# EAGLE schematic VCAMatrixBottom (EAGLE 8.0.2)
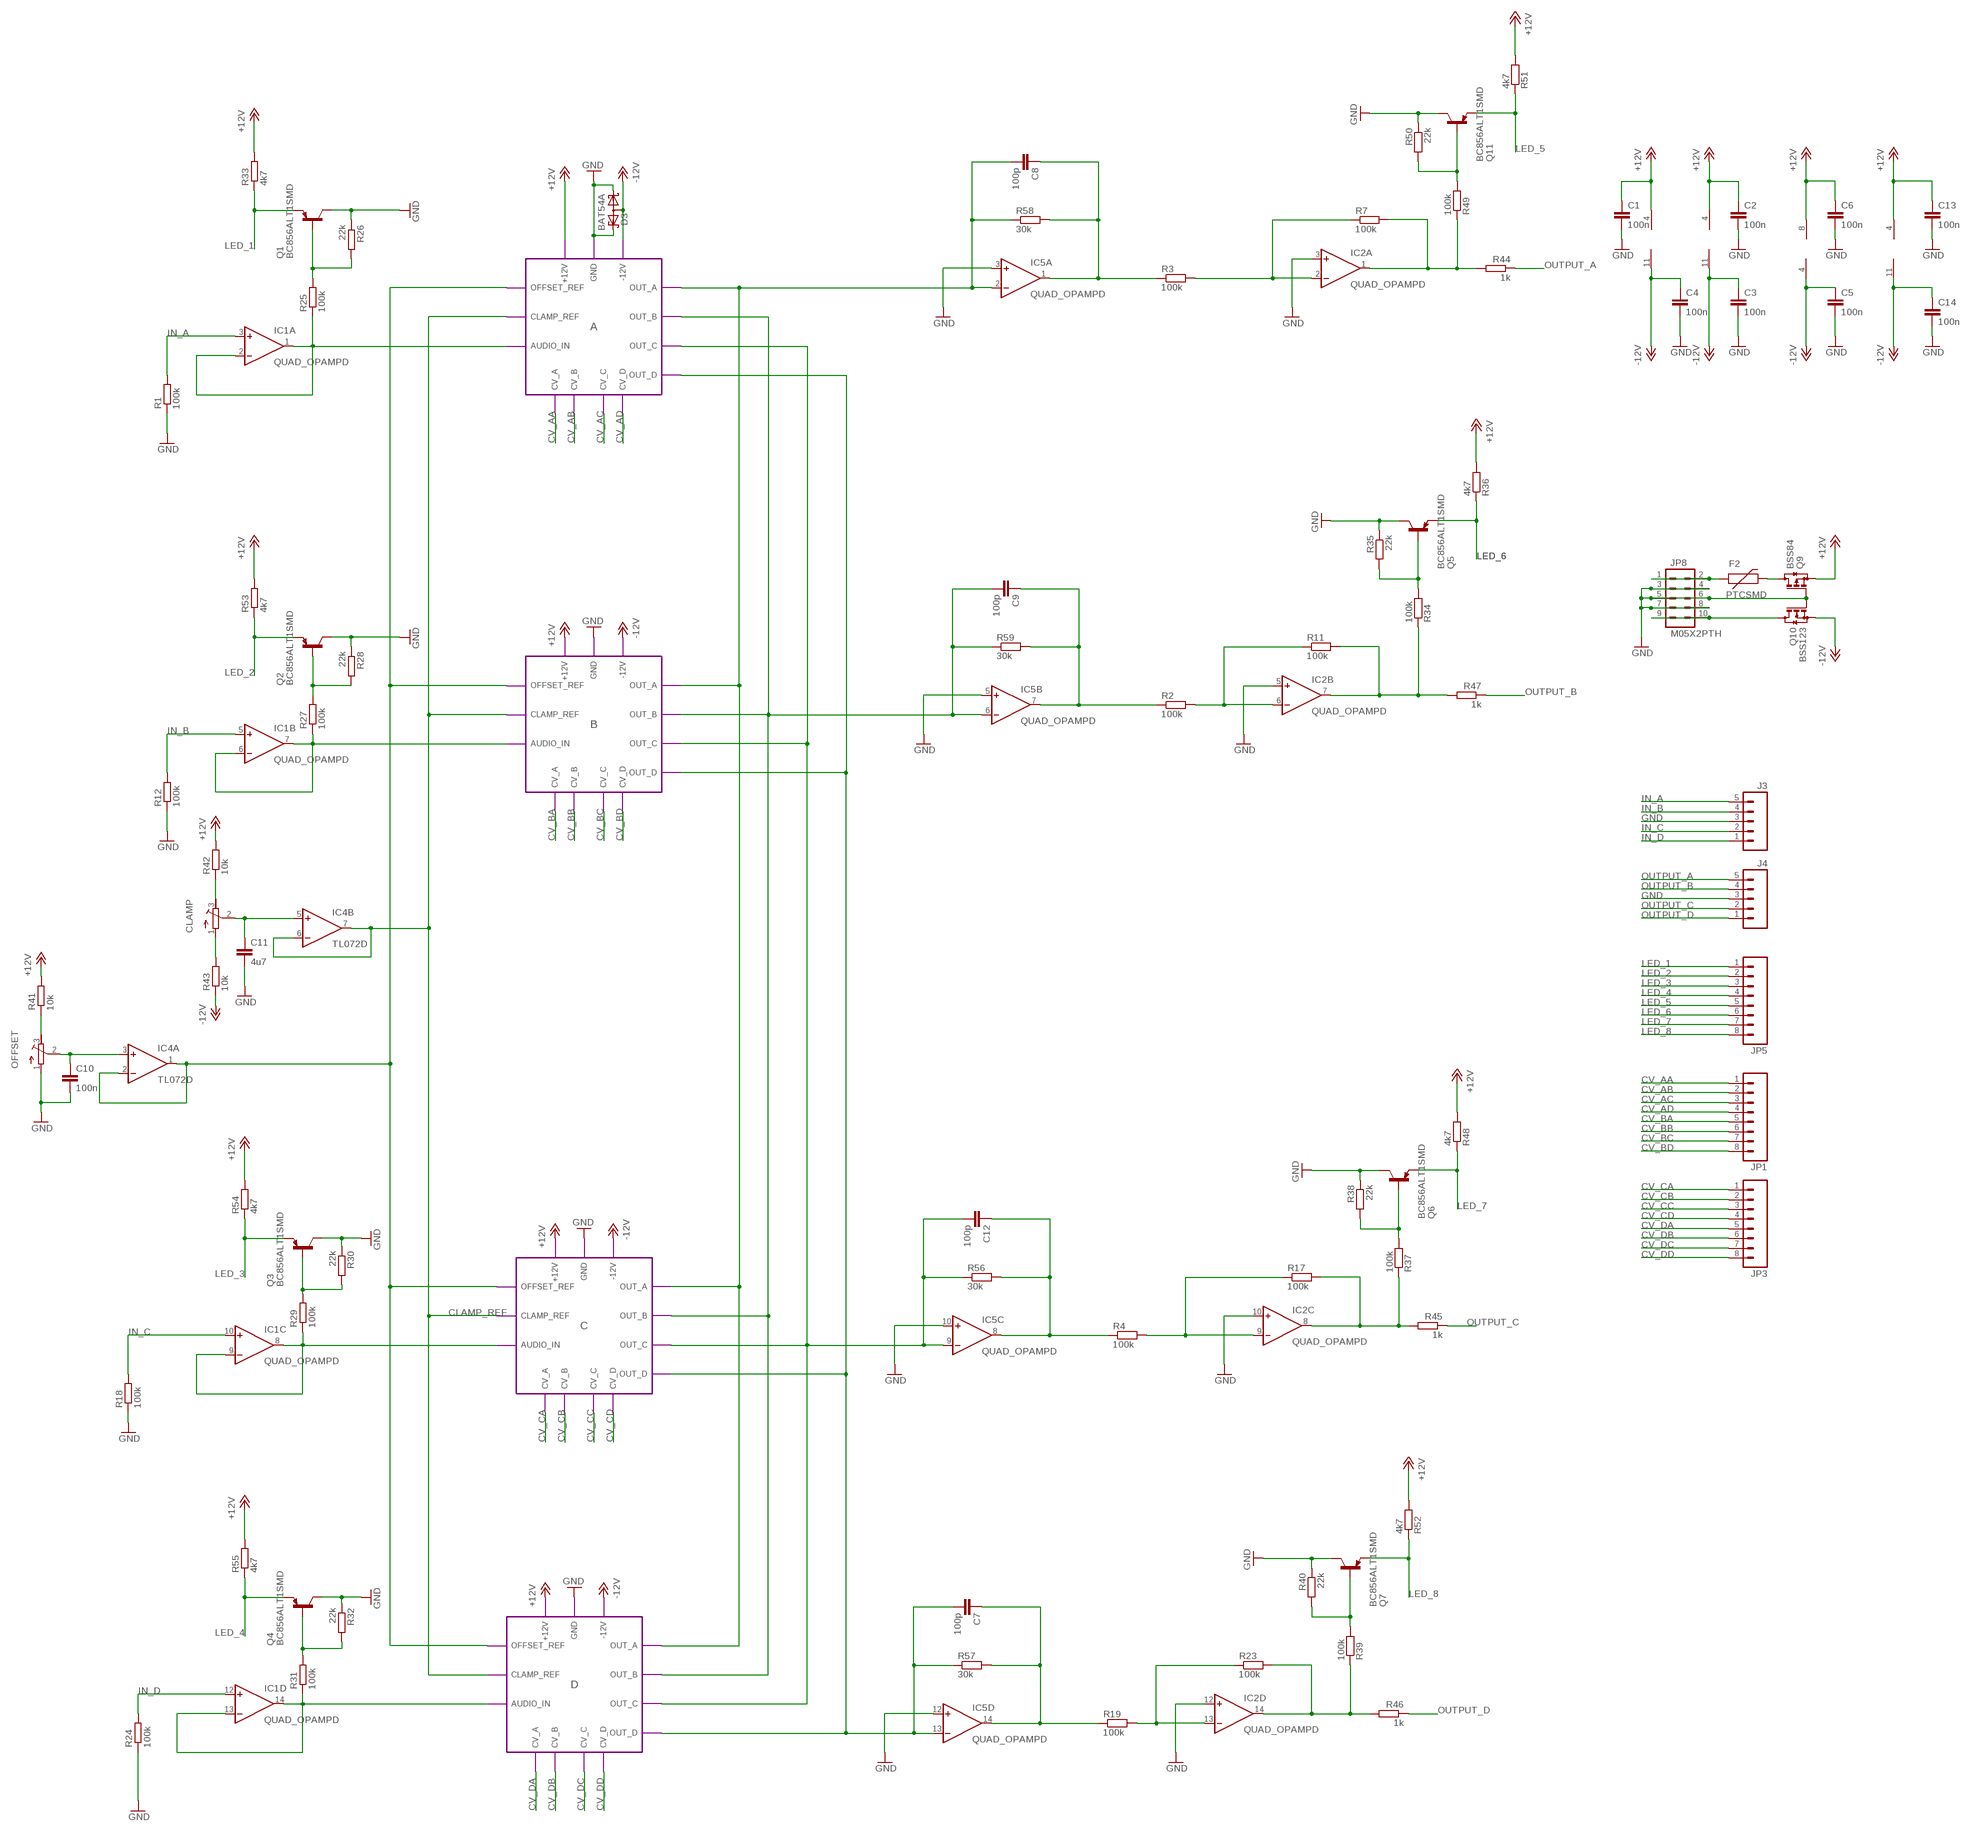
[diagram p0: schematic, sheet 1]

## Parts
C1  100n  C-EUC0603K  [C0603K]
C2  100n  C-EUC0603K  [C0603K]
C3  100n  C-EUC0603K  [C0603K]
C4  100n  C-EUC0603K  [C0603K]
C5  100n  C-EUC0603K  [C0603K]
C6  100n  C-EUC0603K  [C0603K]
C7  100p  C-EUC0603K  [C0603K]
C8  100p  C-EUC0603K  [C0603K]
C9  100p  C-EUC0603K  [C0603K]
C10  100n  C-EUC0603K  [C0603K]
C11  4u7  C-EUC0603K  [C0603K]
C12  100p  C-EUC0603K  [C0603K]
C13  100n  C-EUC0603K  [C0603K]
C14  100n  C-EUC0603K  [C0603K]
CLAMP  R-TRIMM64W  [RTRIM64W]
D3  BAT54A  [SOT23]
F2  PTCSMD  [PTC-1206]
IC1  QUAD_OPAMPD  [SO14]
IC2  QUAD_OPAMPD  [SO14]
IC4  TL072D  [SO08]
IC5  QUAD_OPAMPD  [SO14]
J3  M05PTH  [1X05]
J4  M05PTH  [1X05]
JP1  M081X08  [1X08]
JP3  M081X08  [1X08]
JP5  M081X08  [1X08]
JP8  M05X2PTH  [AVR_ICSP]
OFFSET  R-TRIMM64W  [RTRIM64W]
Q1  BC856ALT1SMD  [SOT23-BEC]
Q2  BC856ALT1SMD  [SOT23-BEC]
Q3  BC856ALT1SMD  [SOT23-BEC]
Q4  BC856ALT1SMD  [SOT23-BEC]
Q5  BC856ALT1SMD  [SOT23-BEC]
Q6  BC856ALT1SMD  [SOT23-BEC]
Q7  BC856ALT1SMD  [SOT23-BEC]
Q9  BSS84  [SOT23]
Q10  BSS123  [SOT23]
Q11  BC856ALT1SMD  [SOT23-BEC]
R1  100k  R-EU_0603  [0603]
R2  100k  R-EU_0603  [0603]
R3  100k  R-EU_0603  [0603]
R4  100k  R-EU_0603  [0603]
R7  100k  R-EU_0603  [0603]
R11  100k  R-EU_0603  [0603]
R12  100k  R-EU_0603  [0603]
R17  100k  R-EU_0603  [0603]
R18  100k  R-EU_0603  [0603]
R19  100k  R-EU_0603  [0603]
R23  100k  R-EU_0603  [0603]
R24  100k  R-EU_0603  [0603]
R25  100k  R-EU_0603  [0603]
R26  22k  R-EU_0603  [0603]
R27  100k  R-EU_0603  [0603]
R28  22k  R-EU_0603  [0603]
R29  100k  R-EU_0603  [0603]
R30  22k  R-EU_0603  [0603]
R31  100k  R-EU_0603  [0603]
R32  22k  R-EU_0603  [0603]
R33  4k7  R-EU_0603  [0603]
R34  100k  R-EU_0603  [0603]
R35  22k  R-EU_0603  [0603]
R36  4k7  R-EU_0603  [0603]
R37  100k  R-EU_0603  [0603]
R38  22k  R-EU_0603  [0603]
R39  100k  R-EU_0603  [0603]
R40  22k  R-EU_0603  [0603]
R41  10k  R-EU_0603  [0603]
R42  10k  R-EU_0603  [0603]
R43  10k  R-EU_0603  [0603]
R44  1k  R-EU_0603  [0603]
R45  1k  R-EU_0603  [0603]
R46  1k  R-EU_0603  [0603]
R47  1k  R-EU_0603  [0603]
R48  4k7  R-EU_0603  [0603]
R49  100k  R-EU_0603  [0603]
R50  22k  R-EU_0603  [0603]
R51  4k7  R-EU_0603  [0603]
R52  4k7  R-EU_0603  [0603]
R53  4k7  R-EU_0603  [0603]
R54  4k7  R-EU_0603  [0603]
R55  4k7  R-EU_0603  [0603]
R56  30k  R-EU_0603  [0603]
R57  30k  R-EU_0603  [0603]
R58  30k  R-EU_0603  [0603]
R59  30k  R-EU_0603  [0603]

## Module instances
A = VCA
B = VCA
C = VCA
D = VCA

## Nets
+12V: C1.1 C2.1 C6.1 C13.1 IC1.4(P:V+) IC2.4(P:V+) IC4.8(P:V+) IC5.4(P:V+) Q9.2(S) R33.2 R36.2 R41.2 R42.2 R48.2 R51.2 R52.2 R53.2 R54.2 R55.2 ; port A.+12V B.+12V C.+12V D.+12V
-12V: C3.1 C4.1 C5.1 C14.1 D3.3(AA) IC1.11(P:V-) IC2.11(P:V-) IC4.4(P:V-) IC5.11(P:V-) Q10.2(S) R43.1 ; port A.-12V B.-12V C.-12V D.-12V
CLAMP_REF: IC4.6(B:-IN) IC4.7(B:OUT) ; port D.CLAMP_REF C.CLAMP_REF B.CLAMP_REF A.CLAMP_REF
CV_AA: JP1.1 ; port A.CV_A
CV_AB: JP1.2 ; port A.CV_B
CV_AC: JP1.3 ; port A.CV_C
CV_AD: JP1.4 ; port A.CV_D
CV_BA: JP1.5 ; port B.CV_A
CV_BB: JP1.6 ; port B.CV_B
CV_BC: JP1.7 ; port B.CV_C
CV_BD: JP1.8 ; port B.CV_D
CV_CA: JP3.1 ; port C.CV_A
CV_CB: JP3.2 ; port C.CV_B
CV_CC: JP3.3 ; port C.CV_C
CV_CD: JP3.4 ; port C.CV_D
CV_DA: JP3.5 ; port D.CV_A
CV_DB: JP3.6 ; port D.CV_B
CV_DC: JP3.7 ; port D.CV_C
CV_DD: JP3.8 ; port D.CV_D
GND: C1.2 C2.2 C3.2 C4.2 C5.2 C6.2 C10.2 C11.2 C13.2 C14.2 D3.1(K1) D3.2(K2) IC2.3(A:+IN) IC2.5(B:+IN) IC2.10(C:+IN) IC2.12(D:+IN) IC5.3(A:+IN) IC5.5(B:+IN) IC5.10(C:+IN) IC5.12(D:+IN) J3.3 J4.3 JP8.3 JP8.4 JP8.5 JP8.6 JP8.7 JP8.8 OFFSET.1(A) Q1.C Q2.C Q3.C Q4.C Q5.C Q6.C Q7.C Q9.1(G) Q10.1(G) Q11.C R1.1 R12.1 R18.1 R24.1 R26.1 R28.1 R30.1 R32.1 R35.1 R38.1 R40.1 R50.1 ; port A.GND B.GND C.GND D.GND
IN_A: IC1.3(A:+IN) J3.5 R1.2
IN_B: IC1.5(B:+IN) J3.4 R12.2
IN_C: IC1.10(C:+IN) J3.2 R18.2
IN_D: IC1.12(D:+IN) J3.1 R24.2
ITOV_A: C8.1 IC5.1(A:OUT) R3.1 R58.2
ITOV_B: C9.1 IC5.7(B:OUT) R2.1 R59.2
ITOV_C: C12.1 IC5.8(C:OUT) R4.1 R56.2
ITOV_D: C7.1 IC5.14(D:OUT) R19.1 R57.2
LED_1: JP5.1 Q1.E R33.1
LED_2: JP5.2 Q2.E R53.1
LED_3: JP5.3 Q3.E R54.1
LED_4: JP5.4 Q4.E R55.1
LED_5: JP5.5 Q11.E R51.1
LED_6: JP5.6 Q5.E R36.1
LED_7: JP5.7 Q6.E R48.1
LED_8: JP5.8 Q7.E R52.1
N$3: IC1.6(B:-IN) IC1.7(B:OUT) R27.1 ; port B.AUDIO_IN
N$4: Q1.B R25.2 R26.2
N$5: JP8.9 JP8.10 Q10.3(D)
N$6: Q2.B R27.2 R28.2
N$7: IC2.2(A:-IN) R3.2 R7.1
N$8: C8.2 IC5.2(A:-IN) R58.1 ; port B.OUT_A C.OUT_A D.OUT_A A.OUT_A
N$9: C12.2 IC5.9(C:-IN) R56.1 ; port A.OUT_C B.OUT_C C.OUT_C D.OUT_C
N$10: C9.2 IC5.6(B:-IN) R59.1 ; port A.OUT_B B.OUT_B C.OUT_B D.OUT_B
N$11: IC2.9(C:-IN) R4.2 R17.1
N$12: Q11.B R49.2 R50.2
N$13: OFFSET.3(E) R41.1
N$14: Q5.B R34.2 R35.2
N$15: Q6.B R37.2 R38.2
N$16: Q7.B R39.2 R40.2
N$17: F2.2 Q9.3(D)
N$18: C7.2 IC5.13(D:-IN) R57.1 ; port D.OUT_D C.OUT_D B.OUT_D A.OUT_D
N$21: Q3.B R29.2 R30.2
N$22: IC1.13(D:-IN) IC1.14(D:OUT) R31.1 ; port D.AUDIO_IN
N$23: IC1.8(C:OUT) IC1.9(C:-IN) R29.1 ; port C.AUDIO_IN
N$24: Q4.B R31.2 R32.2
N$33: C10.1 IC4.3(A:+IN) OFFSET.2(S)
N$44: CLAMP.3(E) R42.1
N$47: IC2.13(D:-IN) R19.2 R23.1
N$59: IC2.6(B:-IN) R2.2 R11.1
N$77: CLAMP.1(A) R43.2
N$78: C11.1 CLAMP.2(S) IC4.5(B:+IN)
N$79: F2.1 JP8.1 JP8.2
N$82: IC1.1(A:OUT) IC1.2(A:-IN) R25.1 ; port A.AUDIO_IN
OFFSET_REF: IC4.1(A:OUT) IC4.2(A:-IN) ; port D.OFFSET_REF C.OFFSET_REF B.OFFSET_REF A.OFFSET_REF
OUT_A: IC2.1(A:OUT) R7.2 R44.2 R49.1
OUT_B: IC2.7(B:OUT) R11.2 R34.1 R47.2
OUT_C: IC2.8(C:OUT) R17.2 R37.1 R45.2
OUT_D: IC2.14(D:OUT) R23.2 R39.1 R46.2
OUTPUT_A: J4.5 R44.1
OUTPUT_B: J4.4 R47.1
OUTPUT_C: J4.2 R45.1
OUTPUT_D: J4.1 R46.1

## Library data of the parts
C1-C6 C13 C14 = Rebel:C-EU: CAPACITOR, European symbol
C7-C12 = resistor:C-EU: CAPACITOR, European symbol
CLAMP OFFSET = resistor:R-TRIMM: Trimm resistor
D3 = diode:BAT54A: Schottky Diodes Source: Fairchild .. BAT54.pdf
F2 = SparkFun:PTC: Resettable Fuse PTC Resettable Fuse. Spark Fun Electronics SKU : COM-08357
IC1 IC2 IC5 = adafruit:QUAD_OPAMP: OP AMP Standard quad package
IC4 = linear:TL072: OP AMP
J3 J4 = SparkFun-Connectors:M05: Header 5 Standard 5-pin 0.1" header. Use with straight break away headers (SKU : PRT-00116), right angle break away headers (PRT-00553), swiss pins (PRT-00743), machine pins (PRT-00117), and female headers (PRT-00115). Molex polarized connector foot print use with SKU : PRT-08230 with associated crimp pins and housings.
JP1 JP3 JP5 = SparkFun:M08: Header 8 Standard 8-pin 0.1" header. Use with straight break away headers (SKU : PRT-00116), right angle break away headers (PRT-00553), swiss pins (PRT-00743), machine pins (PRT-00117), and female headers (PRT-00115).
JP8 = SparkFun:M05X2: Header 5x2 Standard 10-pin dual row 0.1" header. Commonly used with AVR-ISP. Use with Spark Fun Electronics SKU: PRT-00778
Q1-Q7 Q11 = transistor-pnp:BC856*: PNP Transistror
Q9 = transistor-small-signal:BSS84: P-CHANNEL MOS FET; OC_FARNELL: 1779264
Q10 = transistor-small-signal:BSS123: N-CHANNEL MOS FET; OC_FARNELL: 1843725
R1-R4 R7 R11 R12 R17-R19 R23-R59 = Rebel:R-EU_: RESISTOR, European symbol

## Module VCA
Ports: AUDIO_IN(in) CV_A(in) CV_B(in) CV_C(in) CV_D(in) OUT_A(out) OUT_B(out) OUT_C(out) OUT_D(out) +12V(pwr) -12V(pwr) GND(pwr) OFFSET_REF(in) CLAMP_REF(io)
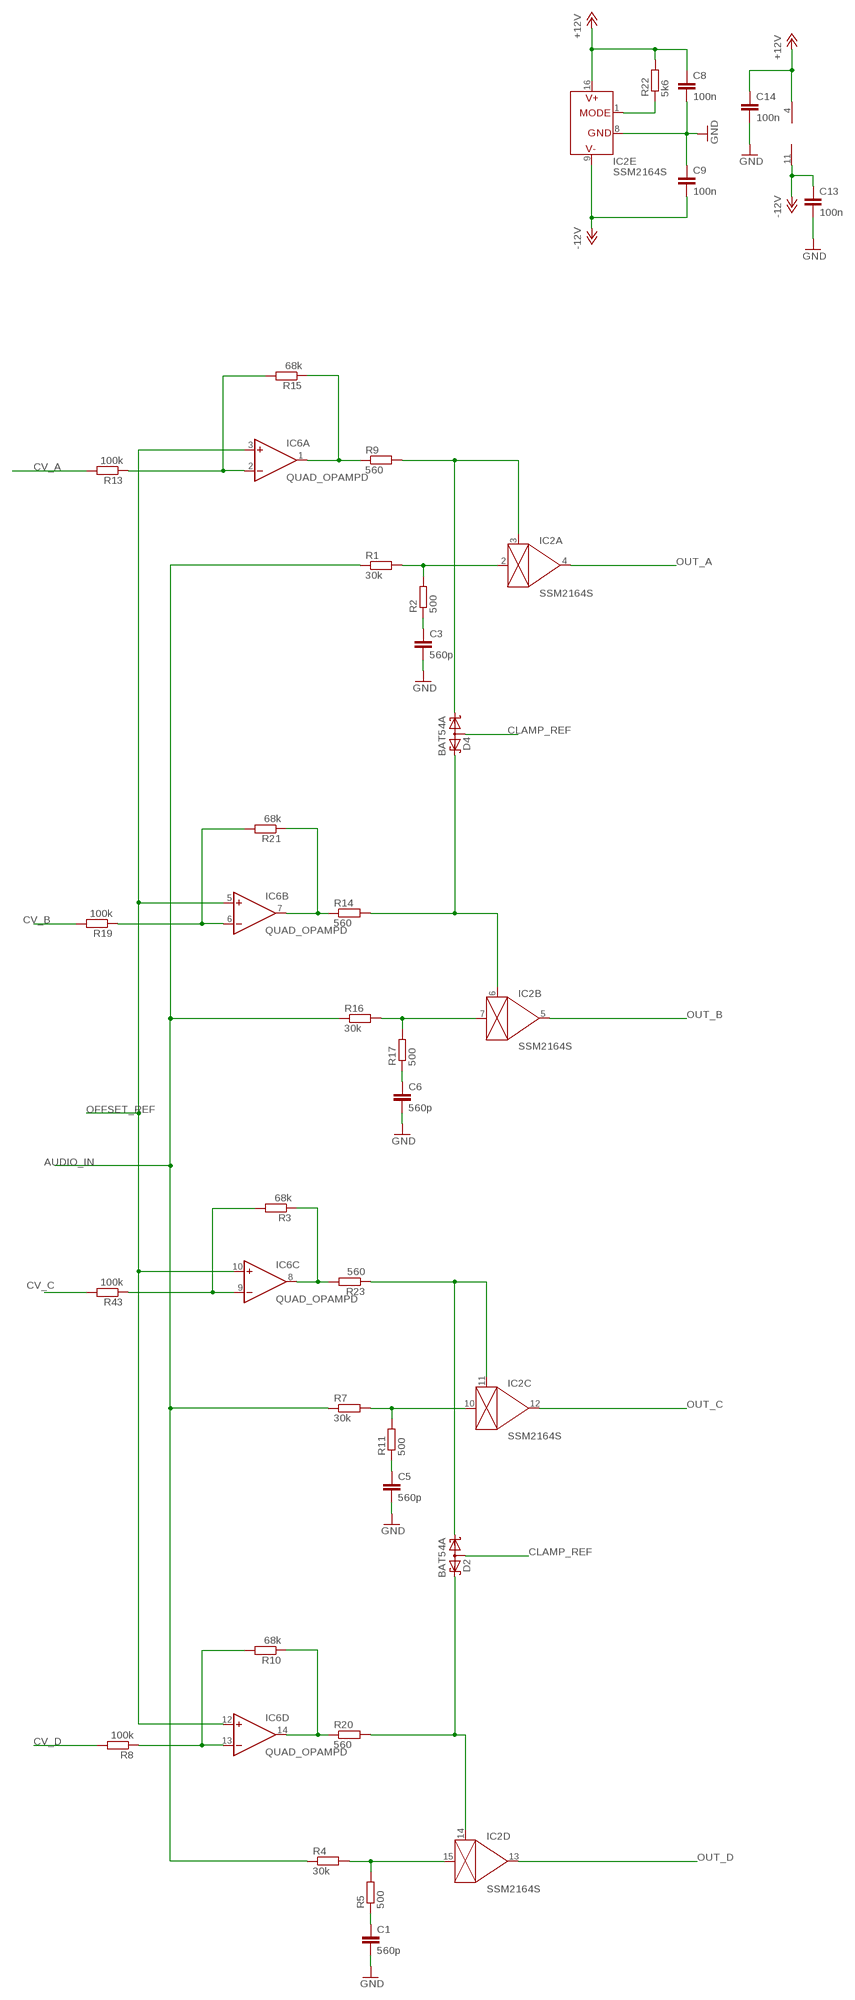
[diagram p1: schematic, module VCA, sheet 1]

### Parts
C1  560p  C-EUC0603K  [C0603K]
C3  560p  C-EUC0603K  [C0603K]
C5  560p  C-EUC0603K  [C0603K]
C6  560p  C-EUC0603K  [C0603K]
C8  100n  C-EUC0603K  [C0603K]
C9  100n  C-EUC0603K  [C0603K]
C13  100n  C-EUC0603K  [C0603K]
C14  100n  C-EUC0603K  [C0603K]
D2  BAT54A  [SOT23]
D4  BAT54A  [SOT23]
IC2  SSM2164S  [SOIC16N]
IC6  QUAD_OPAMPD  [SO14]
R1  30k  R-EU_0603  [0603]
R2  500  R-EU_0603  [0603]
R3  68k  R-EU_0603  [0603]
R4  30k  R-EU_0603  [0603]
R5  500  R-EU_0603  [0603]
R7  30k  R-EU_0603  [0603]
R8  100k  R-EU_0603  [0603]
R9  560  R-EU_0603  [0603]
R10  68k  R-EU_0603  [0603]
R11  500  R-EU_0603  [0603]
R13  100k  R-EU_0603  [0603]
R14  560  R-EU_0603  [0603]
R15  68k  R-EU_0603  [0603]
R16  30k  R-EU_0603  [0603]
R17  500  R-EU_0603  [0603]
R19  100k  R-EU_0603  [0603]
R20  560  R-EU_0603  [0603]
R21  68k  R-EU_0603  [0603]
R22  5k6  R-EU_0603  [0603]
R23  560  R-EU_0603  [0603]
R43  100k  R-EU_0603  [0603]

### Nets
+12V: C8.1 C14.1 IC2.16(E:V+) IC6.4(P:V+) R22.2
-12V: C9.2 C13.1 IC2.9(E:V-) IC6.11(P:V-)
AUDIO_IN: R1.1 R4.1 R7.1 R16.1
CLAMP_REF: D2.3(AA) D4.3(AA)
CV_A: R13.2
CV_B: R19.2
CV_C: R43.2
CV_D: R8.2
GND: C1.2 C3.2 C5.2 C6.2 C8.2 C9.1 C13.2 C14.2 IC2.8(E:GND)
IC2_1: IC6.14(D:OUT) R10.1 R20.1
IC2_2: IC6.13(D:-IN) R8.1 R10.2
IC2_3: IC6.1(A:OUT) R9.1 R15.1
IC2_4: IC6.9(C:-IN) R3.2 R43.1
IC2_5: IC6.2(A:-IN) R13.1 R15.2
IC2_6: IC6.7(B:OUT) R14.1 R21.1
IC2_7: IC6.6(B:-IN) R19.1 R21.2
IC2_11: IC6.8(C:OUT) R3.1 R23.2
N$1: D4.1(K1) IC2.3(A:CTRL) R9.2
N$2: C1.1 R5.1
N$3: C3.1 R2.1
N$4: IC2.15(D:IN) R4.2 R5.2
N$5: IC2.2(A:IN) R1.2 R2.2
N$7: D4.2(K2) IC2.6(B:CTRL) R14.2
N$8: D2.1(K1) IC2.11(C:CTRL) R23.1
N$11: C6.1 R17.1
N$12: IC2.7(B:IN) R16.2 R17.2
N$14: D2.2(K2) IC2.14(D:CTRL) R20.2
N$17: IC2.1(E:MODE) R22.1
N$19: C5.1 R11.1
N$23: IC2.10(C:IN) R7.2 R11.2
OFFSET_REF: IC6.3(A:+IN) IC6.5(B:+IN) IC6.10(C:+IN) IC6.12(D:+IN)
OUT_A: IC2.4(A:OUT)
OUT_B: IC2.5(B:OUT)
OUT_C: IC2.12(C:OUT)
OUT_D: IC2.13(D:OUT)

### Library data of the parts
C1 C3 C5 C6 = resistor:C-EU: CAPACITOR, European symbol
C8 C9 C13 C14 = Rebel:C-EU: CAPACITOR, European symbol
D2 D4 = diode:BAT54A: Schottky Diodes Source: Fairchild .. BAT54.pdf
IC2 = ssm2164:SSM2164
IC6 = adafruit:QUAD_OPAMP: OP AMP Standard quad package
R1-R5 R7-R11 R13-R17 R19-R23 R43 = Rebel:R-EU_: RESISTOR, European symbol